# Altium project Ticket_Dispancer.PrjPcb (part 1 of 3)
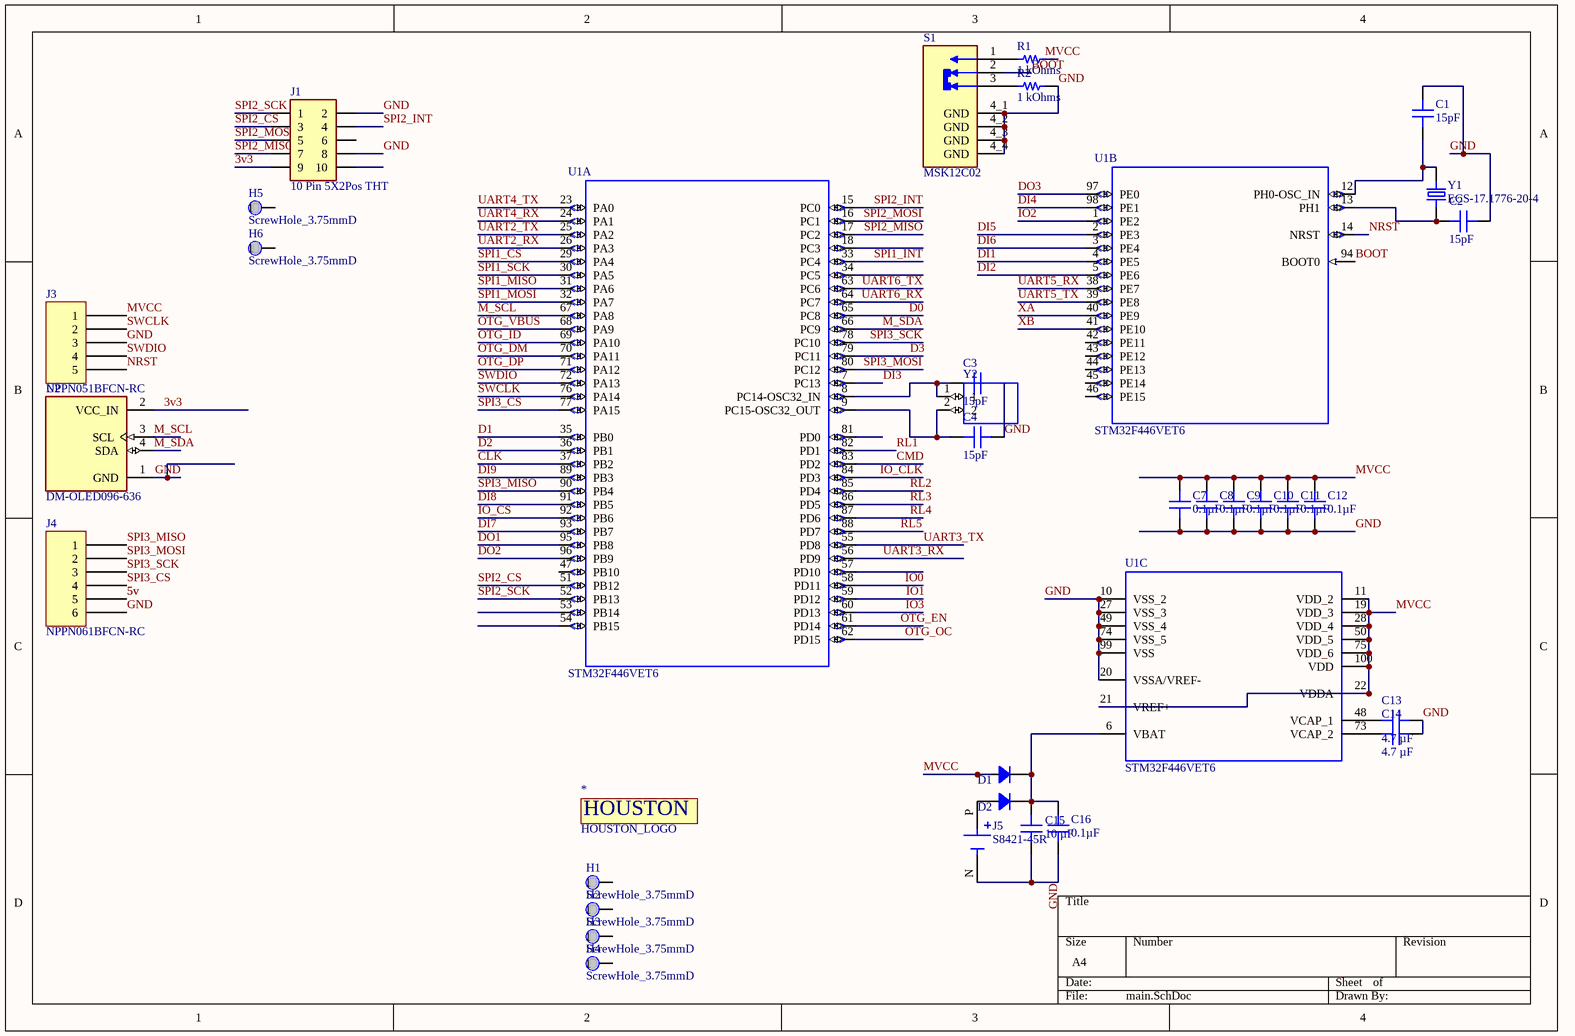
[diagram p0: main.SchDoc]
8 sheets, 297 parts. Net scope: global (net labels, ports and power ports of the same name join across sheets).
Board file: Ticket_Dispancer.PcbDoc
Sheets:
  main.SchDoc
  commucation.SchDoc
  memory.SchDoc
  LAN.SchDoc
  DI_DO.SchDoc
  Relay.SchDoc
  Power.SchDoc
  Usb.SchDoc

## Sheet main.SchDoc
size A4; SheetNumber: 1; SheetTotal: 8

### Parts
*  HOUSTON_LOGO  [HOUSTON_LOGO]
C1  15pF  [CAP 0805_2012]
C2  15pF  [CAP 0805_2012]
C3  15pF  [CAP 0805_2012]
C4  15pF  [CAP 0805_2012]
C7  Capacitance: 0.1µF  [CAP 0805_2012]  (hidden comment: 1µF)
C8  Capacitance: 0.1µF  [CAP 0805_2012]  (hidden comment: 1µF)
C9  Capacitance: 0.1µF  [CAP 0805_2012]  (hidden comment: 1µF)
C10  Capacitance: 0.1µF  [CAP 0805_2012]  (hidden comment: 1µF)
C11  Capacitance: 0.1µF  [CAP 0805_2012]  (hidden comment: 1µF)
C12  Capacitance: 0.1µF  [CAP 0805_2012]  (hidden comment: 1µF)
C13  4.7 µF  [CAP 0805_2012]
C14  4.7 µF  [CAP 0805_2012]
C15  10 µF  [CAP 1206_3216 - 0.8MM]
C16  Capacitance: 0.1µF  [CAP 0805_2012]  (hidden comment: 1µF)
D1  CGRA4007-G  [DO214AC SMA]  (value not drawn)
D2  CGRA4007-G  [DO214AC SMA]  (value not drawn)
H1  ScrewHole_3.75mmD  [ScrewHole_3.75mmD - duplicate]
H2  ScrewHole_3.75mmD  [ScrewHole_3.75mmD - duplicate]
H3  ScrewHole_3.75mmD  [ScrewHole_3.75mmD - duplicate]
H4  ScrewHole_3.75mmD  [ScrewHole_3.75mmD - duplicate]
H5  ScrewHole_3.75mmD  [ScrewHole_3.75mmD - duplicate]
H6  ScrewHole_3.75mmD  [ScrewHole_3.75mmD - duplicate]
J1  10 Pin 5X2Pos THT  [10 Pin 5X2Pos THT]
J3  NPPN051BFCN-RC  [SULLINS NPPN051BFCN]
J4  NPPN061BFCN-RC  [SULLINS NPPN061BFCN]
J5  S8421-45R  [HARWIN_S8421-45R]
R1  1 kOhms  [RES 0805_2012]
R2  1 kOhms  [RES 0805_2012]
S1  MSK12C02  [SW_MSK12C02]
U1  STM32F446VET6  [LQFP100-14X14MM]  (parts A,B,C of 3)
U2  DM-OLED096-636  [MODULE_DM-OLED096-636]
Y1  ECS-17.1776-20-4  [XTAL_ECS-160-20-4X]
Y2  CFS-20632768EZBB  [CFS20632768EZBB]  (value not drawn)

### Nets
3v3: J1.9 U2.2(VCC_IN)
5v: J4.5
BOOT: S1.2 U1.94(BOOT0)
CLK: U1.37(PB2)
CMD: U1.83(PD2)
D0: U1.65(PC8)
D1: U1.35(PB0)
D2: U1.36(PB1)
D3: U1.79(PC11)
DI1: U1.4(PE5)
DI2: U1.5(PE6)
DI3: U1.7(PC13)
DI4: U1.98(PE1)
DI5: U1.2(PE3)
DI6: U1.3(PE4)
DI7: U1.93(PB7)
DI8: U1.91(PB5)
DI9: U1.89(PB3)
DO1: U1.95(PB8)
DO2: U1.96(PB9)
DO3: U1.97(PE0)
GND: C1.2 C2.2 C3.2 C4.2 C7.1 C8.1 C9.1 C10.1 C11.1 C12.1 C13.2 C14.2 C15.1 C16.1 J1.2 J1.8 J3.3 J4.6 J5.N(NEG) R2.2 S1.4_1(GND) S1.4_2(GND) S1.4_3(GND) S1.4_4(GND) U1.10(VSS_2) U1.20(VSSA/VREF-) U1.27(VSS_3) U1.49(VSS_4) U1.74(VSS_5) U1.99(VSS) U2.1(GND)
IO0: U1.58(PD11)
IO1: U1.59(PD12)
IO2: U1.1(PE2)
IO3: U1.60(PD13)
IO_CLK: U1.84(PD3)
IO_CS: U1.92(PB6)
M_SCL: U1.67(PA8) U2.3(SCL)
M_SDA: U1.66(PC9) U2.4(SDA)
MVCC: C7.2 C8.2 C9.2 C10.2 C11.2 C12.2 D1.1 J3.1 R1.1 U1.11(VDD_2) U1.19(VDD_3) U1.21(VREF+) U1.22(VDDA) U1.28(VDD_4) U1.50(VDD_5) U1.75(VDD_6) U1.100(VDD)
NRST: J3.5 U1.14(NRST)
OTG_DM: U1.70(PA11)
OTG_DP: U1.71(PA12)
OTG_EN: U1.61(PD14)
OTG_ID: U1.69(PA10)
OTG_OC: U1.62(PD15)
OTG_VBUS: U1.68(PA9)
RL1: U1.82(PD1)
RL2: U1.85(PD4)
RL3: U1.86(PD5)
RL4: U1.87(PD6)
RL5: U1.88(PD7)
SPI1_CS: U1.29(PA4)
SPI1_INT: U1.33(PC4)
SPI1_MISO: U1.31(PA6)
SPI1_MOSI: U1.32(PA7)
SPI1_SCK: U1.30(PA5)
SPI2_CS: J1.3 U1.51(PB12)
SPI2_INT: J1.4 U1.15(PC0)
SPI2_MISO: J1.7 U1.17(PC2)
SPI2_MOSI: J1.5 U1.16(PC1)
SPI2_SCK: J1.1 U1.52(PB13)
SPI3_CS: J4.4 U1.77(PA15)
SPI3_MISO: J4.1 U1.90(PB4)
SPI3_MOSI: J4.2 U1.80(PC12)
SPI3_SCK: J4.3 U1.78(PC10)
SWCLK: J3.2 U1.76(PA14)
SWDIO: J3.4 U1.72(PA13)
UART2_RX: U1.26(PA3)
UART2_TX: U1.25(PA2)
UART3_RX: U1.56(PD9)
UART3_TX: U1.55(PD8)
UART4_RX: U1.24(PA1)
UART4_TX: U1.23(PA0)
UART5_RX: U1.38(PE7)
UART5_TX: U1.39(PE8)
UART6_RX: U1.64(PC7)
UART6_TX: U1.63(PC6)
XA: U1.40(PE9)
XB: U1.41(PE10)
NetC1_1: C1.1 U1.12(PH0-OSC_IN) Y1.2
NetC2_1: C2.1 U1.13(PH1) Y1.1
NetC3_1: C3.1 U1.8(PC14-OSC32_IN) Y2.1
NetC4_1: C4.1 U1.9(PC15-OSC32_OUT) Y2.2
NetC13_1: C13.1 U1.48(VCAP_1)
NetC14_1: C14.1 U1.73(VCAP_2)
NetC15_2: C15.2 C16.2 D1.2 D2.2 U1.6(VBAT)
NetD2_1: D2.1 J5.P(POS)
NetR1_2: R1.2 S1.1
NetR2_1: R2.1 S1.3

Not connected (* = marked no-connect by the designer): H1 1; H2 1; H3 1; H4 1; H5 1; H6 1; J1 6 10; U1 18(PC3) 34(PC5) 42(PE11) 43(PE12) 44(PE13) 45(PE14) 46(PE15) 47(PB10) 53(PB14) 54(PB15) 57(PD10) 81(PD0)

### Notes on the sheet
- (in symbol HOUSTON_LOGO) HOUSTON

### Library data of the parts
C1-C4 = 08055A150JAT2A: CAP CER 15PF 50V C0G/NP0 0805; manufacturer: AVX Corporation; Temperature Coefficient: C0G, NP0; Tolerance: ±5%; Part Number: 08055A150JAT2A; Capacitance: 15pF; Applications: General Purpose; componentlink1description: Datasheet; componentlink1url: http://datasheets.avx.com/C0GNP0-Dielectric.pdf; componentlink2description: DigiKey Link; componentlink2url: http://digikey.com/product-detail/en/avx-corporation/08055A150JAT2A/478-1306-1-ND/564338; Device Package: 0805 (2012 Metric); lastupdated: 02-09-2020 1.04.40 AM; Lifecycle Status: Active; Minimum Order: 1; Mounting Type: Surface Mount, MLCC; Operating Temperature: -55°C ~ 125°C; Package / Case: 0805 (2012 Metric); packaging: TapeAndReel; partid: 3213; Part Status: Active; price: 0.02; series: -; Size / Dimension: 0.079" L x 0.049" W (2.01mm x 1.25mm); Supplier 1: DigiKey; Supplier Part Number 1: 478-1306-1-ND; Thickness (Max): 0.037" (0.94mm); value: 15pF; Voltage - Rated: 50V
C7-C12 C16 = 0805ZC105KAT4A: CAP CER 1UF 10V X7R 0805; manufacturer: AVX Corporation; Tolerance: ±10%; Part Number: 0805ZC105KAT4A; Applications: General Purpose; componentlink1description: Datasheet; componentlink1url: http://datasheets.avx.com/X7RDielectric.pdf; componentlink2description: DigiKey Link; componentlink2url: http://digikey.com/product-detail/en/avx-corporation/0805ZC105KAT4A/478-7604-1-ND/7536237; Device Package: 0805 (2012 Metric); lastupdated: 02-09-2020 1.04.40 AM; Lifecycle Status: Active; Minimum Order: 1; Mounting Type: Surface Mount, MLCC; Operating Temperature: -55°C ~ 125°C; Package / Case: 0805 (2012 Metric); packaging: TapeAndReel; partid: 3500; Part Status: Active; price: 0.17; series: -; Size / Dimension: 0.079" L x 0.049" W (2.00mm x 1.25mm); Supplier 1: DigiKey; Supplier Part Number 1: 478-7604-1-ND; Temperature Coefficient: X7R; Thickness (Max): 0.037" (0.94mm); value: 1µF; Voltage - Rated: 10V
C13 C14 = C0805X475M3RAC7800: 4.70UF 25.0V; manufacturer: KEMET; Temperature Coefficient: X7R; Tolerance: ±20%; Voltage - Rated: 25V; Part Number: C0805X475M3RAC7800; Capacitance: 4.7 µF; Applications: Boardflex Sensitive; componentlink1description: Datasheet; componentlink1url: https://connect.kemet.com:7667/gateway/IntelliData-ComponentDocumentation/1.0/download/datasheet/C0805X475M3RAC7800; componentlink2description: DigiKey Link; componentlink2url: https://www.digikey.com/en/products/detail/kemet/C0805X475M3RAC7800/12082671; Device Package: 0805 (2012 Metric); Features: Soft Termination; lastupdated: 29-03-2026 7.18.51 PM; Lifecycle Status: Active; Minimum Order: 1; Mounting Type: Surface Mount, MLCC; Operating Temperature: -55°C ~ 125°C; Package / Case: 0805 (2012 Metric); packaging: TapeAndReel; partid: 46494; Part Status: Active; price: 0.15; series: SMD Comm X7R Flex; Size / Dimension: 0.079" L x 0.049" W (2.00mm x 1.25mm); Supplier 1: DigiKey; Supplier Part Number 1: 399-C0805X475M3RAC7800CT-ND; Thickness (Max): 0.057" (1.45mm); value: 4.7 µF
C15 = EMK316BJ106MD-T: CAP CER 10UF 16V X5R 1206; manufacturer: Taiyo Yuden; Tolerance: ±20%; Part Number: EMK316BJ106MD-T; Capacitance: 10 µF; Applications: SMPS Filtering; componentlink1description: Datasheet; componentlink1url: http://www.yuden.co.jp/productdata/catalog/mlcc06_e.pdf; componentlink2description: DigiKey Link; componentlink2url: https://www.digikey.com/en/products/detail/taiyo-yuden/EMK316BJ106MD-T/6563474; Device Package: 1206 (3216 Metric); lastupdated: 04-06-2024 7.10.41 PM; Lifecycle Status: Active; Minimum Order: 1; Mounting Type: Surface Mount, MLCC; Operating Temperature: -55°C ~ 85°C; Package / Case: 1206 (3216 Metric); packaging: TapeAndReel; partid: 18996; Part Status: Active; price: 0.04; series: M; Size / Dimension: 0.126" L x 0.063" W (3.20mm x 1.60mm); Supplier 1: DigiKey; Supplier Part Number 1: 587-4881-1-ND; Temperature Coefficient: X5R; Thickness (Max): 0.037" (0.95mm); value: 10 µF; Voltage - Rated: 16V
D1 D2 = CGRA4007-G: DIODE GEN PURP 1KV 1A DO214AC; Manufacturer: Comchip Technology; Current - Reverse Leakage @ Vr: 5 µA @ 1000 V; Diode Type: Standard; Speed: Standard Recovery >500ns, > 200mA (Io); Voltage - DC Reverse (Vr) (Max): 1000 V; Voltage - Forward (Vf) (Max) @ If: 1.1 V @ 1 A; Part Number: CGRA4007-G; ComponentLink1Description: Datasheet; ComponentLink1URL: http://www.comchiptech.com/admin/files/product/CGRA4001-G Thru647907. CGRA4007-G RevE.pdf; ComponentLink2Description: DigiKey Link; ComponentLink2URL: https://www.digikey.com/en/products/detail/comchip-technology/CGRA4007-G/1121050; Current - Average Rectified (Io): 1A; LastUpdated: 03-06-2024 7.54.36 PM; Lifecycle Status: Active; Minimum Order: 1; Mounting Type: Surface Mount; Operating Temperature - Junction: -55°C ~ 150°C; Package / Case: DO-214AC, SMA; Packaging: TapeAndReel; PartId: 670; Part Status: Active; Price: 0.04; Series: -; Supplier 1: DigiKey; Supplier Part Number 1: 641-1018-1-ND; Supplier Device Package: DO-214AC (SMA)
H1-H6 = ScrewHole_3.75mmD: SCREW HEAD DIA 4.5MM, SREW LEG DIA 3 MM
J1 = 10 Pin 5X2Pos THT: 10 Pin 5X2Pos THT BergeStick 2.54MM MTSW-105-X-X-D-X; MF: {'manufacturer': u'Samtec Inc.'}; Package: None; Price: None; Value: *; MP: MTSW-105-X-X-D-X; Availability: Unavailable
J3 = NPPN051BFCN-RC: CONN HDR 5POS 0.079 GOLD PCB; Manufacturer: Sullins Connector Solutions; Connector Type: Header; Contact Length - Post: 0.094" (2.40mm); Current Rating (Amps): 2A; Material Flammability Rating: UL94 V-0; Number of Positions: 5; Number of Positions Loaded: All; Pitch - Mating: 0.079" (2.00mm); Style: Board to Board; Part Number: NPPN051BFCN-RC; ComponentLink1Description: Datasheet; ComponentLink1URL: https://drawings-pdf.s3.amazonaws.com/10483.pdf; ComponentLink2Description: DigiKey Link; ComponentLink2URL: https://www.digikey.com/en/products/detail/sullins-connector-solutions/NPPN051BFCN-RC/804807; Contact Finish - Mating: Gold; Contact Finish - Post: Gold; Contact Finish Thickness - Mating: Flash; Contact Type: Female Socket; Fastening Type: Push-Pull; Insulation Color: Black; Insulation Height: 0.173" (4.40mm); LastUpdated: 21-06-2022 2.43.08 PM; Lifecycle Status: Active; Minimum Order: 1; Mounting Type: Through Hole; Number of Rows: 1; Operating Temperature: -40°C ~ 105°C; Packaging: Tube; Part Status: Active; Price: 0.35; Series: -; Supplier 1: DigiKey; Supplier Part Number 1: S5751-05-ND; Termination: Solder
J4 = NPPN061BFCN-RC: CONN HDR 6POS 0.079 GOLD PCB; Manufacturer: Sullins Connector Solutions; Connector Type: Header; Contact Length - Post: 0.094" (2.40mm); Current Rating (Amps): 2A; Material Flammability Rating: UL94 V-0; Number of Positions: 6; Number of Positions Loaded: All; Pitch - Mating: 0.079" (2.00mm); Style: Board to Board; Part Number: NPPN061BFCN-RC; ComponentLink1Description: Datasheet; ComponentLink1URL: https://drawings-pdf.s3.amazonaws.com/10483.pdf; ComponentLink2Description: DigiKey Link; ComponentLink2URL: https://www.digikey.com/en/products/detail/sullins-connector-solutions/NPPN061BFCN-RC/804808; Contact Finish - Mating: Gold; Contact Finish - Post: Gold; Contact Finish Thickness - Mating: Flash; Contact Type: Female Socket; Fastening Type: Push-Pull; Insulation Color: Black; Insulation Height: 0.173" (4.40mm); LastUpdated: 21-06-2022 2.43.22 PM; Lifecycle Status: Active; Minimum Order: 1; Mounting Type: Through Hole; Number of Rows: 1; Operating Temperature: -40°C ~ 105°C; Packaging: Tube; Part Status: Active; Price: 0.40; Series: -; Supplier 1: DigiKey; Supplier Part Number 1: S5751-06-ND; Termination: Solder
J5 = S8421-45R: Coin Cell Battery Retainer, Horizontal SMT, for CR2032 Coin Cell Batteries, Tape & Reeled; MF: Harwin; SnapEDA_Link: https://www.snapeda.com/parts/S8421-45R/Harwin+Inc./view-part/?ref=snap; Package: None; Value: *; MP: S8421-45R; Check_prices: https://www.snapeda.com/parts/S8421-45R/Harwin+Inc./view-part/?ref=eda
R1 R2 = ESR10EZPF1001: RES SMD 1K OHM 1% 0.4W 0805; Manufacturer: Rohm Semiconductor; Power (Watts): 0.4W, 2/5W; Temperature Coefficient: ±100ppm/°C; Part Number: ESR10EZPF1001; Value: 1 kOhms; ComponentLink1Description: Datasheet; ComponentLink1URL: https://www.rohm.com/datasheet/ESR01MZPF/esr-e; ComponentLink2Description: DigiKey Link; ComponentLink2URL: https://www.digikey.com/en/products/detail/rohm-semiconductor/ESR10EZPF1001/1983480; Composition: Thick Film; Device Package: 0805 (2012 Metric); Features: Automotive AEC-Q200, Pulse Withstanding; Height - Seated (Max): 0.026" (0.65mm); LastUpdated: 08-02-2024 9.02.37 PM; Lifecycle Status: Active; Minimum Order: 1; Number of Terminations: 2; Operating Temperature: -55°C ~ 155°C; Package / Case: 0805 (2012 Metric); Packaging: TapeAndReel; PartId: 28032; Part Status: Active; Price: 0.02; Ratings: AEC-Q200; Resistance: 1 kOhms; Series: ESR; Size / Dimension: 0.079" L x 0.049" W (2.00mm x 1.25mm); Supplier 1: DigiKey; Supplier Part Number 1: RHM1.00KAECT-ND; Supplier Device Package: 0805; Tolerance: ±1%
U1 = STM32F446VET6: ARMÂ® CortexÂ®-M4 STM32F4 Microcontroller IC 32-Bit Single-Core 180MHz 512KB (512K x 8) FLASH 100-LQFP (14x14); MF: STMicroelectronics; SnapEDA_Link: https://www.snapeda.com/parts/STM32F446VET6/STMicroelectronics/view-part/?ref=snap; Package: LQFP-100 STMicroelectronics; Value: *; MP: STM32F446VET6; Check_prices: https://www.snapeda.com/parts/STM32F446VET6/STMicroelectronics/view-part/?ref=eda
U2 = DM-OLED096-636: 0.96â€ 128 X 64 MONOCHROME GRAPHIC OLED DISPLAY MODULE - I2C; SnapEDA_Link: https://www.snapeda.com/parts/DM-OLED096-636/Display+Module/view-part/?ref=snap; Package: Package; Value: *; MF: Display Module; MP: DM-OLED096-636; Check_prices: https://www.snapeda.com/parts/DM-OLED096-636/Display+Module/view-part/?ref=eda
Y1 = ECS-17.1776-20-4: Crystals 17.1776MHz HC49S; MF: ECS International; SnapEDA_Link: https://www.snapeda.com/parts/ECS-17.1776-20-4/ECS/view-part/?ref=snap; Package: HC-49US ECS Inc.; Value: *; MP: ECS-17.1776-20-4; Check_prices: https://www.snapeda.com/parts/ECS-17.1776-20-4/ECS/view-part/?ref=eda
Y2 = CFS-20632768EZBB: 32.768kHz Â±10ppm Crystal 6pF 35 kOhms Cylindrical Can, Radial; MF: Citizen Finedevice; SnapEDA_Link: https://www.snapeda.com/parts/CFS-20632768EZBB/Citizen%20Finedevice%20Co%20Ltd/view-part/2815870/?ref=snap; Availability: Warning; Package: Cylindrical Can Radial  Citizen Finetech Miyota; Price: None; MP: CFS-20632768EZBB; Value: *; Purchase-URL: https://pricing.snapeda.com/search/part/CFS-20632768EZBB/?ref=eda; Check_prices: https://www.snapeda.com/parts/CFS-20632768EZBB/Citizen%20Finedevice%20Co%20Ltd/view-part/2815870/?ref=eda
S1 = MSK12C02: Package: None; Price: None; Value: *; MP: MSK12C02; Availability: Unavailable

## Sheet commucation.SchDoc
size A4; SheetNumber: 2; SheetTotal: 8
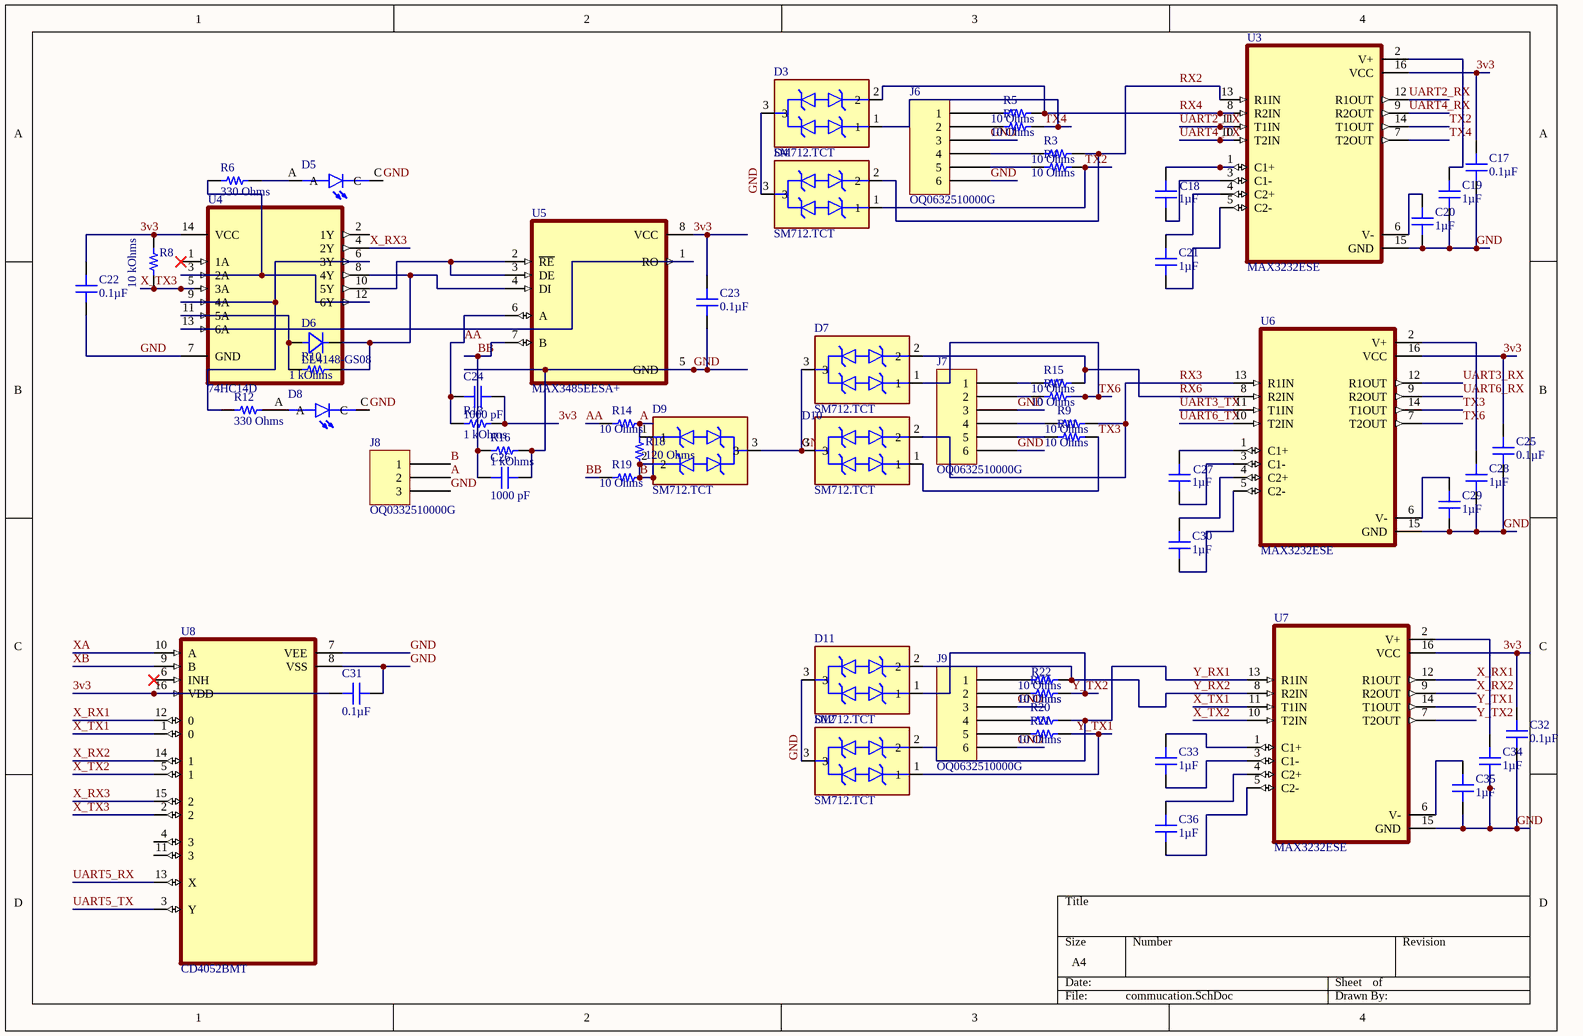
[diagram p1: commucation.SchDoc]

### Parts
C17  Capacitance: 0.1µF  [CAP 0805_2012]  (hidden comment: 1µF)
C18  1µF  [CAP 0805_2012]
C19  1µF  [CAP 0805_2012]
C20  1µF  [CAP 0805_2012]
C21  1µF  [CAP 0805_2012]
C22  Capacitance: 0.1µF  [CAP 0805_2012]  (hidden comment: 1µF)
C23  Capacitance: 0.1µF  [CAP 0805_2012]  (hidden comment: 1µF)
C24  1000 pF  [CAP 0805_2012]
C25  Capacitance: 0.1µF  [CAP 0805_2012]  (hidden comment: 1µF)
C26  1000 pF  [CAP 0805_2012]
C27  1µF  [CAP 0805_2012]
C28  1µF  [CAP 0805_2012]
C29  1µF  [CAP 0805_2012]
C30  1µF  [CAP 0805_2012]
C31  Capacitance: 0.1µF  [CAP 0805_2012]  (hidden comment: 1µF)
C32  Capacitance: 0.1µF  [CAP 0805_2012]  (hidden comment: 1µF)
C33  1µF  [CAP 0805_2012]
C34  1µF  [CAP 0805_2012]
C35  1µF  [CAP 0805_2012]
C36  1µF  [CAP 0805_2012]
D3  SM712.TCT  [SM712.TCT]
D4  SM712.TCT  [SM712.TCT]
D5  597-3305-607F  [LEDC2012X70N]  (value not drawn)
D6  LL4148-GS08  [MELF_SOD-80]
D7  SM712.TCT  [SM712.TCT]
D8  597-3305-607F  [LEDC2012X70N]  (value not drawn)
D9  SM712.TCT  [SM712.TCT]
D10  SM712.TCT  [SM712.TCT]
D11  SM712.TCT  [SM712.TCT]
D12  SM712.TCT  [SM712.TCT]
J6  OQ0632510000G  [FCI 06-381-6PIN]
J7  OQ0632510000G  [FCI 06-381-6PIN]
J8  OQ0332510000G  [FCI 06-381-3PIN]
J9  OQ0632510000G  [FCI 06-381-6PIN]
R3  10 Ohms  [RES 0805_2012]
R4  10 Ohms  [RES 0805_2012]
R5  10 Ohms  [RES 0805_2012]
R6  330 Ohms  [RES 0805_2012]
R7  10 Ohms  [RES 0805_2012]
R8  10 kOhms  [RES 0805_2012]
R9  10 Ohms  [RES 0805_2012]
R10  1 kOhms  [RES 0805_2012]
R11  10 Ohms  [RES 0805_2012]
R12  330 Ohms  [RES 0805_2012]
R13  1 kOhms  [RES 0805_2012]
R14  10 Ohms  [RES 0805_2012]
R15  10 Ohms  [RES 0805_2012]
R16  1 kOhms  [RES 0805_2012]
R17  10 Ohms  [RES 0805_2012]
R18  120 Ohms  [RES 0805_2012]
R19  10 Ohms  [RES 0805_2012]
R20  10 Ohms  [RES 0805_2012]
R21  10 Ohms  [RES 0805_2012]
R22  10 Ohms  [RES 0805_2012]
R23  10 Ohms  [RES 0805_2012]
U3  MAX3232ESE  [SOIC127P600X175-16N]
U4  74HC14D  [SOIC127P600X175-14N]
U5  MAX3485EESA+  [SOIC127P600X175-8N]
U6  MAX3232ESE  [SOIC127P600X175-16N]
U7  MAX3232ESE  [SOIC127P600X175-16N]
U8  CD4052BMT  [SOIC127P600X175-16N]

### Nets
3v3: C17.2 C22.2 C23.2 C24.2 C25.2 C31.1 C32.2 R8.2 R13.2 U3.16(VCC) U4.14(VCC) U5.8(VCC) U6.16(VCC) U7.16(VCC) U8.16(VDD)
A: D9.1 J8.2 R14.2 R18.2
AA: C24.1 R13.1 R14.1 U5.6(A)
B: D9.2 J8.1 R18.1 R19.2
BB: C26.1 R16.1 R19.1 U5.7(B)
GND: C17.1 C19.1 C20.1 C22.1 C23.1 C25.1 C26.2 C28.1 C29.1 C31.2 C32.1 C34.1 C35.1 D3.3 D4.3 D5.C D7.3 D8.C D9.3 D10.3 D11.3 D12.3 J6.3 J6.6 J7.3 J7.6 J8.3 J9.3 J9.6 R16.2 U3.15(GND) U4.7(GND) U5.5(GND) U6.15(GND) U7.15(GND) U8.7(VEE) U8.8(VSS)
RX2: D4.2 R3.2 U3.13(R1IN)
RX3: D10.2 R9.2 U6.13(R1IN)
RX4: D3.2 R5.2 U3.8(R2IN)
RX6: D7.2 R15.2 U6.8(R2IN)
TX2: D4.1 R4.2 U3.14(T1OUT)
TX3: D10.1 R11.2 U6.14(T1OUT)
TX4: D3.1 R7.2 U3.7(T2OUT)
TX6: D7.1 R17.2 U6.7(T2OUT)
UART2_RX: U3.12(R1OUT)
UART2_TX: U3.11(T1IN)
UART3_RX: U6.12(R1OUT)
UART3_TX: U6.11(T1IN)
UART4_RX: U3.9(R2OUT)
UART4_TX: U3.10(T2IN)
UART5_RX: U8.13(X)
UART5_TX: U8.3(Y)
UART6_RX: U6.9(R2OUT)
UART6_TX: U6.10(T2IN)
X_RX1: U7.12(R1OUT) U8.12(0)
X_RX2: U7.9(R2OUT) U8.14(1)
X_RX3: U4.4(2Y) U8.15(2)
X_TX1: U7.11(T1IN) U8.1(0)
X_TX2: U7.10(T2IN) U8.5(1)
X_TX3: R8.1 U4.5(3A) U8.2
XA: U8.10(A)
XB: U8.9(B)
Y_RX1: D12.2 R20.2 U7.13(R1IN)
Y_RX2: D11.2 R22.2 U7.8(R2IN)
Y_TX1: D12.1 R21.2 U7.14(T1OUT)
Y_TX2: D11.1 R23.2 U7.7(T2OUT)
NetC18_1: C18.1 U3.3(C1-)
NetC18_2: C18.2 U3.1(C1+)
NetC19_2: C19.2 U3.2(V+)
NetC20_2: C20.2 U3.6(V-)
NetC21_1: C21.1 U3.5(C2-)
NetC21_2: C21.2 U3.4(C2+)
NetC27_1: C27.1 U6.3(C1-)
NetC27_2: C27.2 U6.1(C1+)
NetC28_2: C28.2 U6.2(V+)
NetC29_2: C29.2 U6.6(V-)
NetC30_1: C30.1 U6.5(C2-)
NetC30_2: C30.2 U6.4(C2+)
NetC33_1: C33.1 U7.3(C1-)
NetC33_2: C33.2 U7.1(C1+)
NetC34_2: C34.2 U7.2(V+)
NetC35_2: C35.2 U7.6(V-)
NetC36_1: C36.1 U7.5(C2-)
NetC36_2: C36.2 U7.4(C2+)
NetD5_A: D5.A R6.2
NetD6_1: D6.1 R10.1 U4.11(5A)
NetD6_2: D6.2 R10.2 U4.8(4Y) U5.4(DI)
NetD8_A: D8.A R12.2
NetJ6_1: J6.1 R5.1
NetJ6_2: J6.2 R7.1
NetJ6_4: J6.4 R3.1
NetJ6_5: J6.5 R4.1
NetJ7_1: J7.1 R15.1
NetJ7_2: J7.2 R17.1
NetJ7_4: J7.4 R9.1
NetJ7_5: J7.5 R11.1
NetJ9_1: J9.1 R22.1
NetJ9_2: J9.2 R23.1
NetJ9_4: J9.4 R20.1
NetJ9_5: J9.5 R21.1
NetR6_1: R6.1 U4.3(2A) U4.12(6Y)
NetR12_1: R12.1 U4.6(3Y) U4.9(4A)
NetU4_10: U4.10(5Y) U5.2(~{RE}) U5.3(DE)
NetU4_13: U4.13(6A) U5.1(RO)

Not connected (* = marked no-connect by the designer): U4 1(1A)* 2(1Y); U8 4(3) 6(INH)* 11(3)

### Library data of the parts
C17-C23 C25 C27-C36 = 0805ZC105KAT4A: as C7 on sheet main; Part Number: 0805ZC105KAT4A; Applications: General Purpose; componentlink1description: Datasheet; componentlink1url: http://datasheets.avx.com/X7RDielectric.pdf; componentlink2description: DigiKey Link; componentlink2url: http://digikey.com/product-detail/en/avx-corporation/0805ZC105KAT4A/478-7604-1-ND/7536237; Device Package: 0805 (2012 Metric); lastupdated: 02-09-2020 1.04.40 AM; Lifecycle Status: Active; Minimum Order: 1; Mounting Type: Surface Mount, MLCC; Operating Temperature: -55°C ~ 125°C; Package / Case: 0805 (2012 Metric); packaging: TapeAndReel; partid: 3500; Part Status: Active; price: 0.17; series: -; Size / Dimension: 0.079" L x 0.049" W (2.00mm x 1.25mm); Supplier 1: DigiKey; Supplier Part Number 1: 478-7604-1-ND; Temperature Coefficient: X7R; Thickness (Max): 0.037" (0.94mm); value: 1µF; Voltage - Rated: 10V
  C18-C21 C27-C30 C33-C36: Capacitance: 1µF
C24 C26 = C0805C102F3HACAUTO: CAP CER 0805 1NF 25V ULTRA STABL; manufacturer: KEMET; Temperature Coefficient: X8R; Tolerance: ±1%; Part Number: C0805C102F3HACAUTO; Capacitance: 1000 pF; Applications: Automotive; componentlink1description: Datasheet; componentlink1url: https://api.kemet.com/component-edge/download/datasheet/C0805C102F3HACAUTO.pdf; componentlink2description: DigiKey Link; componentlink2url: https://www.digikey.com/en/products/detail/kemet/C0805C102F3HACAUTO/7958218; Device Package: 0805 (2012 Metric); Features: Low ESL, High Temperature; lastupdated: 09-02-2024 8.15.10 PM; Lifecycle Status: Active; Minimum Order: 1; Mounting Type: Surface Mount, MLCC; Operating Temperature: -55°C ~ 150°C; Package / Case: 0805 (2012 Metric); packaging: TapeAndReel; partid: 32894; Part Status: Active; price: 0.04; Ratings: AEC-Q200; series: SMD Auto X8R HT150C; Size / Dimension: 0.079" L x 0.049" W (2.00mm x 1.25mm); Supplier 1: DigiKey; Supplier Part Number 1: 399-C0805C102F3HACAUTOCT-ND; Thickness (Max): 0.035" (0.88mm); value: 1000 pF; Voltage - Rated: 25V
D3 D4 D7 D9-D12 = SM712.TCT: SM Series 12 V 400 W Asymmetrical TVS Diode for Extended Common-Mode - SOT-23; MF: Semtech Corporation; SnapEDA_Link: https://www.snapeda.com/parts/SM712.TCT/Semtech/view-part/?ref=snap; Package: SOT-23 Semtech; Value: *; MP: SM712.TCT; Check_prices: https://www.snapeda.com/parts/SM712.TCT/Semtech/view-part/?ref=eda
D5 D8 = 597-3305-607F: LED Uni-Color Green 4-Pin Chip 0805 T/R; Availability: Unavailable; Value: *; Price: None; MP: 597-3305-607F; Package: None
D6 = LL4148-GS08: Diode Standard 75 V 300mA (DC) Surface Mount SOD-80 MiniMELF; MF: Vishay General Semiconductor - Diodes Division; SnapEDA_Link: https://www.snapeda.com/parts/LL4148-GS08/Vishay+General+Semiconductor+-+Diodes+Division/view-part/?ref=snap; Package: SOD-80 Vishay Semiconductor Diodes Division; Value: *; MP: LL4148-GS08; Check_prices: https://www.snapeda.com/parts/LL4148-GS08/Vishay+General+Semiconductor+-+Diodes+Division/view-part/?ref=eda
J6 J7 J9 = OQ0632510000G: TERM BLOCK HDR 6POS 90DEG 3.81MM; Manufacturer: Amphenol Anytek; Current - UL: 10A; Header Orientation: 90°, Right Angle; Number of Levels: 1; Number of Positions: 6; Pitch: 0.150" (3.81mm); Voltage - UL: 300V; Part Number: OQ0632510000G; Color: Green; ComponentLink1Description: Datasheet; ComponentLink1URL: http://portal.fciconnect.com/Comergent//fci/drawing/oqxx32x100j0g.pdf; ComponentLink2Description: DigiKey Link; ComponentLink2URL: //digikey.com/product-detail/en/amphenol-anytek/OQ0632510000G/609-3823-ND/2261282; Contact Mating Finish: Tin; LastUpdated: 16-12-2019 7.16.11 PM; Lifecycle Status: 0; Minimum Order: 1; Mounting Type: Through Hole; Operating Temperature: -40°C ~ 115°C; Packaging: Bulk; Part Status: Active; Positions Per Level: 6; Price: 0.80; Series: 06-381; Supplier 1: DigiKey; Supplier Part Number 1: 609-3823-ND; Termination Style: Solder; Type: Header, Male Pins, Shrouded (4 Side)
J8 = OQ0332510000G: TERM BLOCK HDR 3POS 90DEG 3.81MM; Manufacturer: Amphenol Anytek; Current - UL: 10A; Header Orientation: 90°, Right Angle; Number of Levels: 1; Number of Positions: 3; Pitch: 0.150" (3.81mm); Voltage - UL: 300V; Part Number: OQ0332510000G; Color: Green; ComponentLink1Description: Datasheet; ComponentLink1URL: http://portal.fciconnect.com/Comergent//fci/drawing/oqxx32x100j0g.pdf; ComponentLink2Description: DigiKey Link; ComponentLink2URL: //digikey.com/product-detail/en/amphenol-anytek/OQ0332510000G/609-3820-ND/2261261; Contact Mating Finish: Tin; LastUpdated: 16-12-2019 7.14.46 PM; Lifecycle Status: 0; Minimum Order: 1; Mounting Type: Through Hole; Operating Temperature: -40°C ~ 115°C; Packaging: Bulk; Part Status: Active; Positions Per Level: 3; Price: 0.53; Series: 06-381; Supplier 1: DigiKey; Supplier Part Number 1: 609-3820-ND; Termination Style: Solder; Type: Header, Male Pins, Shrouded (4 Side)
R3-R5 R7 R9 R11 R14 R15 R17 R19-R23 = RNCS0805BKE10R0: RES 10 OHM 0.1% 1/10W 0805; Manufacturer: Stackpole Electronics Inc; Power (Watts): 0.1W, 1/10W; Temperature Coefficient: ±25ppm/°C; Part Number: RNCS0805BKE10R0; Value: 10 Ohms; ComponentLink1Description: Datasheet; ComponentLink1URL: https://www.seielect.com/catalog/sei-rncs_rnch.pdf; ComponentLink2Description: DigiKey Link; ComponentLink2URL: https://www.digikey.com/en/products/detail/stackpole-electronics-inc/RNCS0805BKE10R0/1800064; Composition: Thin Film; Device Package: 0805 (2012 Metric); Features: Anti-Corrosive, Automotive AEC-Q200, Moisture Resistant; Height - Seated (Max): 0.026" (0.65mm); LastUpdated: 08-02-2024 9.02.39 PM; Lifecycle Status: Active; Minimum Order: 1; Number of Terminations: 2; Operating Temperature: -55°C ~ 155°C; Package / Case: 0805 (2012 Metric); Packaging: TapeAndReel; PartId: 27711; Part Status: Active; Price: 0.07; Ratings: AEC-Q200; Resistance: 10 Ohms; Series: RNCS; Size / Dimension: 0.079" L x 0.049" W (2.00mm x 1.25mm); Supplier 1: DigiKey; Supplier Part Number 1: RNCS0805BKE10R0CT-ND; Supplier Device Package: 0805; Tolerance: ±0.1%
R6 R12 = CRCW0805330RFKEAHP: RES SMD 330 OHM 1% 1/2W 0805; Manufacturer: Vishay Dale; Power (Watts): 0.5W, 1/2W; Temperature Coefficient: ±100ppm/°C; Part Number: CRCW0805330RFKEAHP; Value: 330 Ohms; ComponentLink1Description: Datasheet; ComponentLink1URL: http://www.vishay.com/docs/20043/crcwhpe3.pdf; ComponentLink2Description: DigiKey Link; ComponentLink2URL: https://www.digikey.com/en/products/detail/vishay-dale/CRCW0805330RFKEAHP/2226912; Composition: Thick Film; Device Package: 0805 (2012 Metric); Features: Automotive AEC-Q200, Pulse Withstanding; Height - Seated (Max): 0.020" (0.50mm); LastUpdated: 08-02-2024 9.02.28 PM; Lifecycle Status: Active; Minimum Order: 1; Number of Terminations: 2; Operating Temperature: -55°C ~ 155°C; Package / Case: 0805 (2012 Metric); Packaging: TapeAndReel; PartId: 30364; Part Status: Active; Price: 0.02; Ratings: AEC-Q200; Resistance: 330 Ohms; Series: CRCW-HP; Size / Dimension: 0.079" L x 0.049" W (2.00mm x 1.25mm); Supplier 1: DigiKey; Supplier Part Number 1: 541-330TCT-ND; Supplier Device Package: 0805; Tolerance: ±1%
R8 = CPF0805B10KE: RES SMD 10K OHM 0.1% 1/10W 0805; Manufacturer: TE Connectivity Passive Product; Power (Watts): 0.1W, 1/10W; Temperature Coefficient: ±25ppm/°C; Part Number: CPF0805B10KE; Value: 10 kOhms; ComponentLink1Description: Datasheet; ComponentLink1URL: https://www.te.com/commerce/DocumentDelivery/DDEController?Action=srchrtrv&DocNm=1773200&DocType=DS&DocLang=English; ComponentLink2Description: DigiKey Link; ComponentLink2URL: https://www.digikey.com/en/products/detail/te-connectivity-passive-product/CPF0805B10KE/2389790; Composition: Thin Film; Device Package: 0805 (2012 Metric); Height - Seated (Max): 0.026" (0.65mm); LastUpdated: 08-02-2024 9.02.39 PM; Lifecycle Status: Active; Minimum Order: 1; Number of Terminations: 2; Operating Temperature: -55°C ~ 155°C; Package / Case: 0805 (2012 Metric); Packaging: TapeAndReel; PartId: 27724; Part Status: Active; Price: 0.09; Resistance: 10 kOhms; Series: CPF, Neohm; Size / Dimension: 0.079" L x 0.049" W (2.00mm x 1.25mm); Supplier 1: DigiKey; Supplier Part Number 1: A106043CT-ND; Supplier Device Package: 0805; Tolerance: ±0.1%
R10 R13 R16 = CPF0805B1K0E: RES SMD 1K OHM 0.1% 1/10W 0805; Manufacturer: TE Connectivity Passive Product; Power (Watts): 0.1W, 1/10W; Temperature Coefficient: ±25ppm/°C; Part Number: CPF0805B1K0E; Value: 1 kOhms; ComponentLink1Description: Datasheet; ComponentLink1URL: https://www.te.com/commerce/DocumentDelivery/DDEController?Action=srchrtrv&DocNm=1773200&DocType=DS&DocLang=English; ComponentLink2Description: DigiKey Link; ComponentLink2URL: https://www.digikey.com/en/products/detail/te-connectivity-passive-product/CPF0805B1K0E/2390399; Composition: Thin Film; Device Package: 0805 (2012 Metric); Height - Seated (Max): 0.026" (0.65mm); LastUpdated: 08-02-2024 9.02.39 PM; Lifecycle Status: Active; Minimum Order: 1; Number of Terminations: 2; Operating Temperature: -55°C ~ 155°C; Package / Case: 0805 (2012 Metric); Packaging: TapeAndReel; PartId: 27725; Part Status: Active; Price: 0.09; Resistance: 1 kOhms; Series: CPF, Neohm; Size / Dimension: 0.079" L x 0.049" W (2.00mm x 1.25mm); Supplier 1: DigiKey; Supplier Part Number 1: A106044CT-ND; Supplier Device Package: 0805; Tolerance: ±0.1%
R18 = RMCF0805FT120R: RES 120 OHM 1% 1/8W 0805; Manufacturer: Stackpole Electronics Inc; Power (Watts): 0.125W, 1/8W; Temperature Coefficient: ±100ppm/°C; Part Number: RMCF0805FT120R; Value: 120 Ohms; ComponentLink1Description: Datasheet; ComponentLink1URL: https://www.seielect.com/catalog/sei-rmcf_rmcp.pdf; ComponentLink2Description: DigiKey Link; ComponentLink2URL: https://www.digikey.com/en/products/detail/stackpole-electronics-inc/RMCF0805FT120R/1712658; Composition: Thick Film; Device Package: 0805 (2012 Metric); Features: Automotive AEC-Q200; Height - Seated (Max): 0.026" (0.65mm); LastUpdated: 08-02-2024 9.02.18 PM; Lifecycle Status: Active; Minimum Order: 1; Number of Terminations: 2; Operating Temperature: -55°C ~ 155°C; Package / Case: 0805 (2012 Metric); Packaging: CutTape; PartId: 32530; Part Status: Active; Price: 0.01; Ratings: AEC-Q200; Resistance: 120 Ohms; Series: RMCF; Size / Dimension: 0.079" L x 0.049" W (2.00mm x 1.25mm); Supplier 1: DigiKey; Supplier Part Number 1: 738-RMCF0805FT120RCT-ND; Supplier Device Package: 0805; Tolerance: ±1%
U3 U6 U7 = MAX3232ESE: Dual Transmitter/Receiver RS-232 16-Pin SOIC N T/R; MF: Analog Devices; MP: MAX3232ESE+T; SnapEDA_Link: https://www.snapeda.com/parts/MAX3232ESE+T/Analog+Devices/view-part/?ref=snap; Package: SOIC-16 Maxim Integrated; Value: *; Check_prices: https://www.snapeda.com/parts/MAX3232ESE+T/Analog+Devices/view-part/?ref=eda
U4 = 74HC14D: Inverter IC 6 Channel Schmitt Trigger 14-SOIC; MF: Toshiba; SnapEDA_Link: https://www.snapeda.com/parts/74HC14D/Toshiba/view-part/?ref=snap; Package: SO14-14 Nexperia USA Inc.; Value: *; MP: 74HC14D; Check_prices: https://www.snapeda.com/parts/74HC14D/Toshiba/view-part/?ref=eda
U5 = MAX3485EESA+: 3.3V Powered, Â±15kV ESD-Protected, 12Mbps, Slew-Rate-Limited True RS-485/RS-422 Transceivers; MF: Analog Devices; SnapEDA_Link: https://www.snapeda.com/parts/MAX3485EESA+/Analog+Devices/view-part/?ref=snap; Package: SOIC-8 Maxim; Value: *; MP: MAX3485EESA+; Check_prices: https://www.snapeda.com/parts/MAX3485EESA+/Analog+Devices/view-part/?ref=eda
U8 = CD4052BMT: 20-V, 4:1, 2-channel general-purpose multiplexer; MF: Texas Instruments; SnapEDA_Link: https://www.snapeda.com/parts/CD4052BMT/Texas+Instruments/view-part/?ref=snap; Package: SOIC-16 Texas Instruments; Value: *; MP: CD4052BMT; Check_prices: https://www.snapeda.com/parts/CD4052BMT/Texas+Instruments/view-part/?ref=eda

## Sheet memory.SchDoc
size A4; SheetNumber: 3; SheetTotal: 8
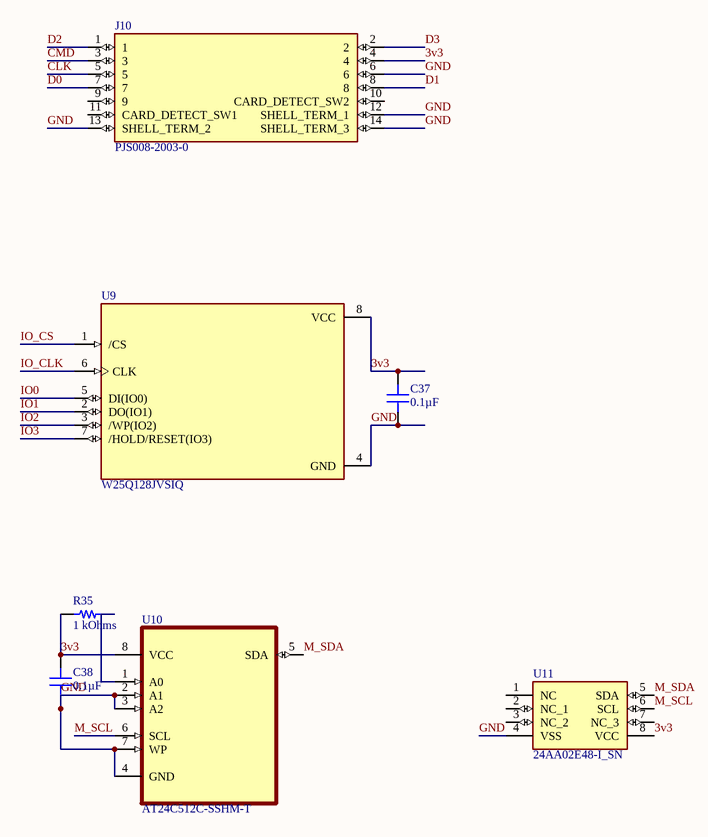
[diagram p2: memory.SchDoc]

### Parts
C37  Capacitance: 0.1µF  [CAP 0805_2012]  (hidden comment: 1µF)
C38  Capacitance: 0.1µF  [CAP 0805_2012]  (hidden comment: 1µF)
J10  PJS008-2003-0  [PJS008-2003-0]
R35  1 kOhms  [RES 0805_2012]
U9  W25Q128JVSIQ  [SOIC127P790X216-8N]
U10  AT24C512C-SSHM-T  [SOIC127P600X175-8N]
U11  24AA02E48-I_SN  [SOIC127P600X175-8N]

### Nets
3v3: C37.2 C38.2 J10.4 R35.1 U9.8(VCC) U10.8(VCC) U11.8(VCC)
CLK: J10.5
CMD: J10.3
D0: J10.7
D1: J10.8
D2: J10.1
D3: J10.2
GND: C37.1 C38.1 J10.6 J10.12(SHELL_TERM_1) J10.13(SHELL_TERM_2) J10.14(SHELL_TERM_3) U9.4(GND) U10.2(A1) U10.3(A2) U10.4(GND) U10.7(WP) U11.4(VSS)
IO0: U9.5(DI(IO0))
IO1: U9.2(DO(IO1))
IO2: U9.3(/WP(IO2))
IO3: U9.7(/HOLD/RESET(IO3))
IO_CLK: U9.6(CLK)
IO_CS: U9.1(/CS)
M_SCL: U10.6(SCL) U11.6(SCL)
M_SDA: U10.5(SDA) U11.5(SDA)
NetR35_2: R35.2 U10.1(A0)

Not connected (* = marked no-connect by the designer): J10 9 10(CARD_DETECT_SW2) 11(CARD_DETECT_SW1); U11 1(NC) 2(NC_1) 3(NC_2) 7(NC_3)

### Library data of the parts
C37 C38 = 0805ZC105KAT4A: as C7 on sheet main; Part Number: 0805ZC105KAT4A; Applications: General Purpose; componentlink1description: Datasheet; componentlink1url: http://datasheets.avx.com/X7RDielectric.pdf; componentlink2description: DigiKey Link; componentlink2url: http://digikey.com/product-detail/en/avx-corporation/0805ZC105KAT4A/478-7604-1-ND/7536237; Device Package: 0805 (2012 Metric); lastupdated: 02-09-2020 1.04.40 AM; Lifecycle Status: Active; Minimum Order: 1; Mounting Type: Surface Mount, MLCC; Operating Temperature: -55°C ~ 125°C; Package / Case: 0805 (2012 Metric); packaging: TapeAndReel; partid: 3500; Part Status: Active; price: 0.17; series: -; Size / Dimension: 0.079" L x 0.049" W (2.00mm x 1.25mm); Supplier 1: DigiKey; Supplier Part Number 1: 478-7604-1-ND; Temperature Coefficient: X7R; Thickness (Max): 0.037" (0.94mm); value: 1µF; Voltage - Rated: 10V
J10 = PJS008-2003-0: Memory Card Connectors MicroSD Crd Conn SMT Revrs Mnt Push-Push; MF: Yamaichi Electronics; SnapEDA_Link: https://www.snapeda.com/parts/PJS008-2003-0/ICH/view-part/?ref=snap; Package: None; Value: *; MP: PJS008-2003-0; Check_prices: https://www.snapeda.com/parts/PJS008-2003-0/ICH/view-part/?ref=eda
R35 = ESR10EZPF1001: as R1 on sheet main; Part Number: ESR10EZPF1001; Value: 1 kOhms; ComponentLink1Description: Datasheet; ComponentLink1URL: https://www.rohm.com/datasheet/ESR01MZPF/esr-e; ComponentLink2Description: DigiKey Link; ComponentLink2URL: https://www.digikey.com/en/products/detail/rohm-semiconductor/ESR10EZPF1001/1983480; Composition: Thick Film; Device Package: 0805 (2012 Metric); Features: Automotive AEC-Q200, Pulse Withstanding; Height - Seated (Max): 0.026" (0.65mm); LastUpdated: 08-02-2024 9.02.37 PM; Lifecycle Status: Active; Minimum Order: 1; Number of Terminations: 2; Operating Temperature: -55°C ~ 155°C; Package / Case: 0805 (2012 Metric); Packaging: TapeAndReel; PartId: 28032; Part Status: Active; Price: 0.02; Ratings: AEC-Q200; Resistance: 1 kOhms; Series: ESR; Size / Dimension: 0.079" L x 0.049" W (2.00mm x 1.25mm); Supplier 1: DigiKey; Supplier Part Number 1: RHM1.00KAECT-ND; Supplier Device Package: 0805; Tolerance: ±1%
U9 = W25Q128JVSIQ: FLASH - NOR Memory IC 128Mb (16M x 8) SPI - Quad I/O, QPI, DTR 133 MHz 8-SOIC; MF: Winbond Electronics; SnapEDA_Link: https://www.snapeda.com/parts/W25Q128JVSIQ/Winbond/view-part/?ref=snap; Package: SOIC-8 Winbond Electronics; Value: *; MP: W25Q128JVSIQ; Check_prices: https://www.snapeda.com/parts/W25Q128JVSIQ/Winbond/view-part/?ref=eda
U10 = AT24C512C-SSHM-T: EEPROM Memory IC 512Kb (64K x 8) IÂ²C 400 kHz 900 ns 8-SOIC; MF: Microchip; SnapEDA_Link: https://www.snapeda.com/parts/AT24C512C-SSHM-T/Microchip/view-part/?ref=snap; Package: SO-8 Microchip; Value: *; MP: AT24C512C-SSHM-T; Check_prices: https://www.snapeda.com/parts/AT24C512C-SSHM-T/Microchip/view-part/?ref=eda
U11 = 24AA02E48-I_SN: Microchip 24AA02E48-I/SN Serial EEPROM Memory,2kb,3500ns,1.7 to 5.5V 8-Pin SOIC | Microchip Technology Inc. 24AA02E48-I/SN; SnapEDA_Link: https://www.snapeda.com/parts/24AA02E48-I/SN/Microchip/view-part/?ref=snap; Package: SO-8 Microchip; Value: *; MF: Microchip; MP: 24AA02E48-I/SN; Check_prices: https://www.snapeda.com/parts/24AA02E48-I/SN/Microchip/view-part/?ref=eda